# EAGLE schematic PocketBeagleCape (EAGLE 8.4.2)
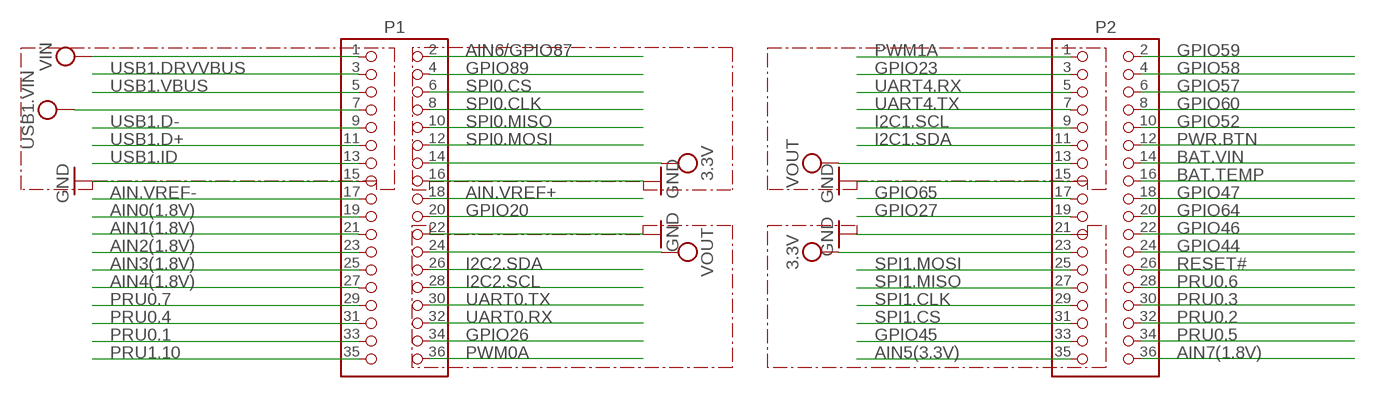
[diagram p0: schematic, sheet 1]

## Parts
P1  2X18-(INCH)-0.1-TH-(35MIL-DIA)-W/O-SILK  [TH-2X18-(35MIL-DIA)-W/O-SILK]
P2  2X18-(INCH)-0.1-TH-(35MIL-DIA)-W/O-SILK  [TH-2X18-(35MIL-DIA)-W/O-SILK]

## Nets
3.3V: P1.14 P2.23
AIN0(1.8V): P1.19
AIN1(1.8V): P1.21
AIN2(1.8V): P1.23
AIN3(1.8V): P1.25
AIN4(1.8V): P1.27
AIN5(3.3V): P2.35
AIN6/GPIO87: P1.2
AIN7(1.8V): P2.36
AIN.VREF+: P1.18
AIN.VREF-: P1.17
BAT.TEMP: P2.16
BAT.VIN: P2.14
GND [power]: P1.15 P1.16 P1.22 P2.15 P2.21
GPIO20: P1.20
GPIO23: P2.3
GPIO26: P1.34
GPIO27: P2.19
GPIO44: P2.24
GPIO45: P2.33
GPIO46: P2.22
GPIO47: P2.18
GPIO52: P2.10
GPIO57: P2.6
GPIO58: P2.4
GPIO59: P2.2
GPIO60: P2.8
GPIO64: P2.20
GPIO65: P2.17
GPIO89: P1.4
I2C1.SCL: P2.9
I2C1.SDA: P2.11
I2C2.SCL: P1.28
I2C2.SDA: P1.26
PRU0.1: P1.33
PRU0.2: P2.32
PRU0.3: P2.30
PRU0.4: P1.31
PRU0.5: P2.34
PRU0.6: P2.28
PRU0.7: P1.29
PRU1.10: P1.35
PWM0A: P1.36
PWM1A: P2.1
PWR.BTN: P2.12
RESET#: P2.26
SPI0.CLK: P1.8
SPI0.CS: P1.6
SPI0.MISO: P1.10
SPI0.MOSI: P1.12
SPI1.CLK: P2.29
SPI1.CS: P2.31
SPI1.MISO: P2.27
SPI1.MOSI: P2.25
UART0.RX: P1.32
UART0.TX: P1.30
UART4.RX: P2.5
UART4.TX: P2.7
USB1.D+: P1.11
USB1.D-: P1.9
USB1.DRVVBUS: P1.3
USB1.ID: P1.13
USB1.VBUS: P1.5
VIN: P1.1
VIN.USB: P1.7 ; supply symbol labelled USB1.VIN
VOUT: P1.24 P2.13

## Library data of the parts
P1 P2 = GHI-Headers:2X18-(INCH)-0.1-